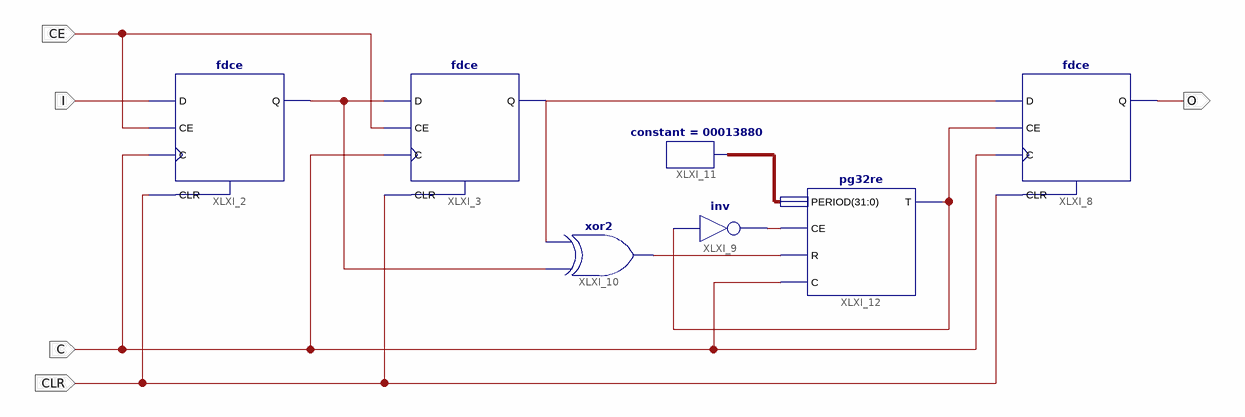
[diagram p0: schematic sheet 1]
// Xilinx ISE schematic debouncer.sch (spartan6) as structural Verilog: 7 symbols, 5 ports
module debouncer (
  input  C,
  input  I,
  input  CLR,
  input  CE,
  output O
);

  wire XLXN_49, XLXN_65, XLXN_76, XLXN_99, XLXN_115;
  wire [31:0] XLXN_119;

  fdce XLXI_2 (.C(C), .CE(CE), .CLR(CLR), .D(I), .Q(XLXN_49));
  fdce XLXI_3 (.C(C), .CE(CE), .CLR(CLR), .D(XLXN_49), .Q(XLXN_65));
  fdce XLXI_8 (.C(C), .CE(XLXN_76), .CLR(CLR), .D(XLXN_65), .Q(O));
  not XLXI_9 (XLXN_115, XLXN_76);
  xor XLXI_10 (XLXN_99, XLXN_49, XLXN_65);
  pg32re XLXI_12 (.C(C), .CE(XLXN_115), .PERIOD(XLXN_119), .R(XLXN_99), .T(XLXN_76));
  constant #(.CValue("00013880")) XLXI_11 (.O(XLXN_119));
endmodule
